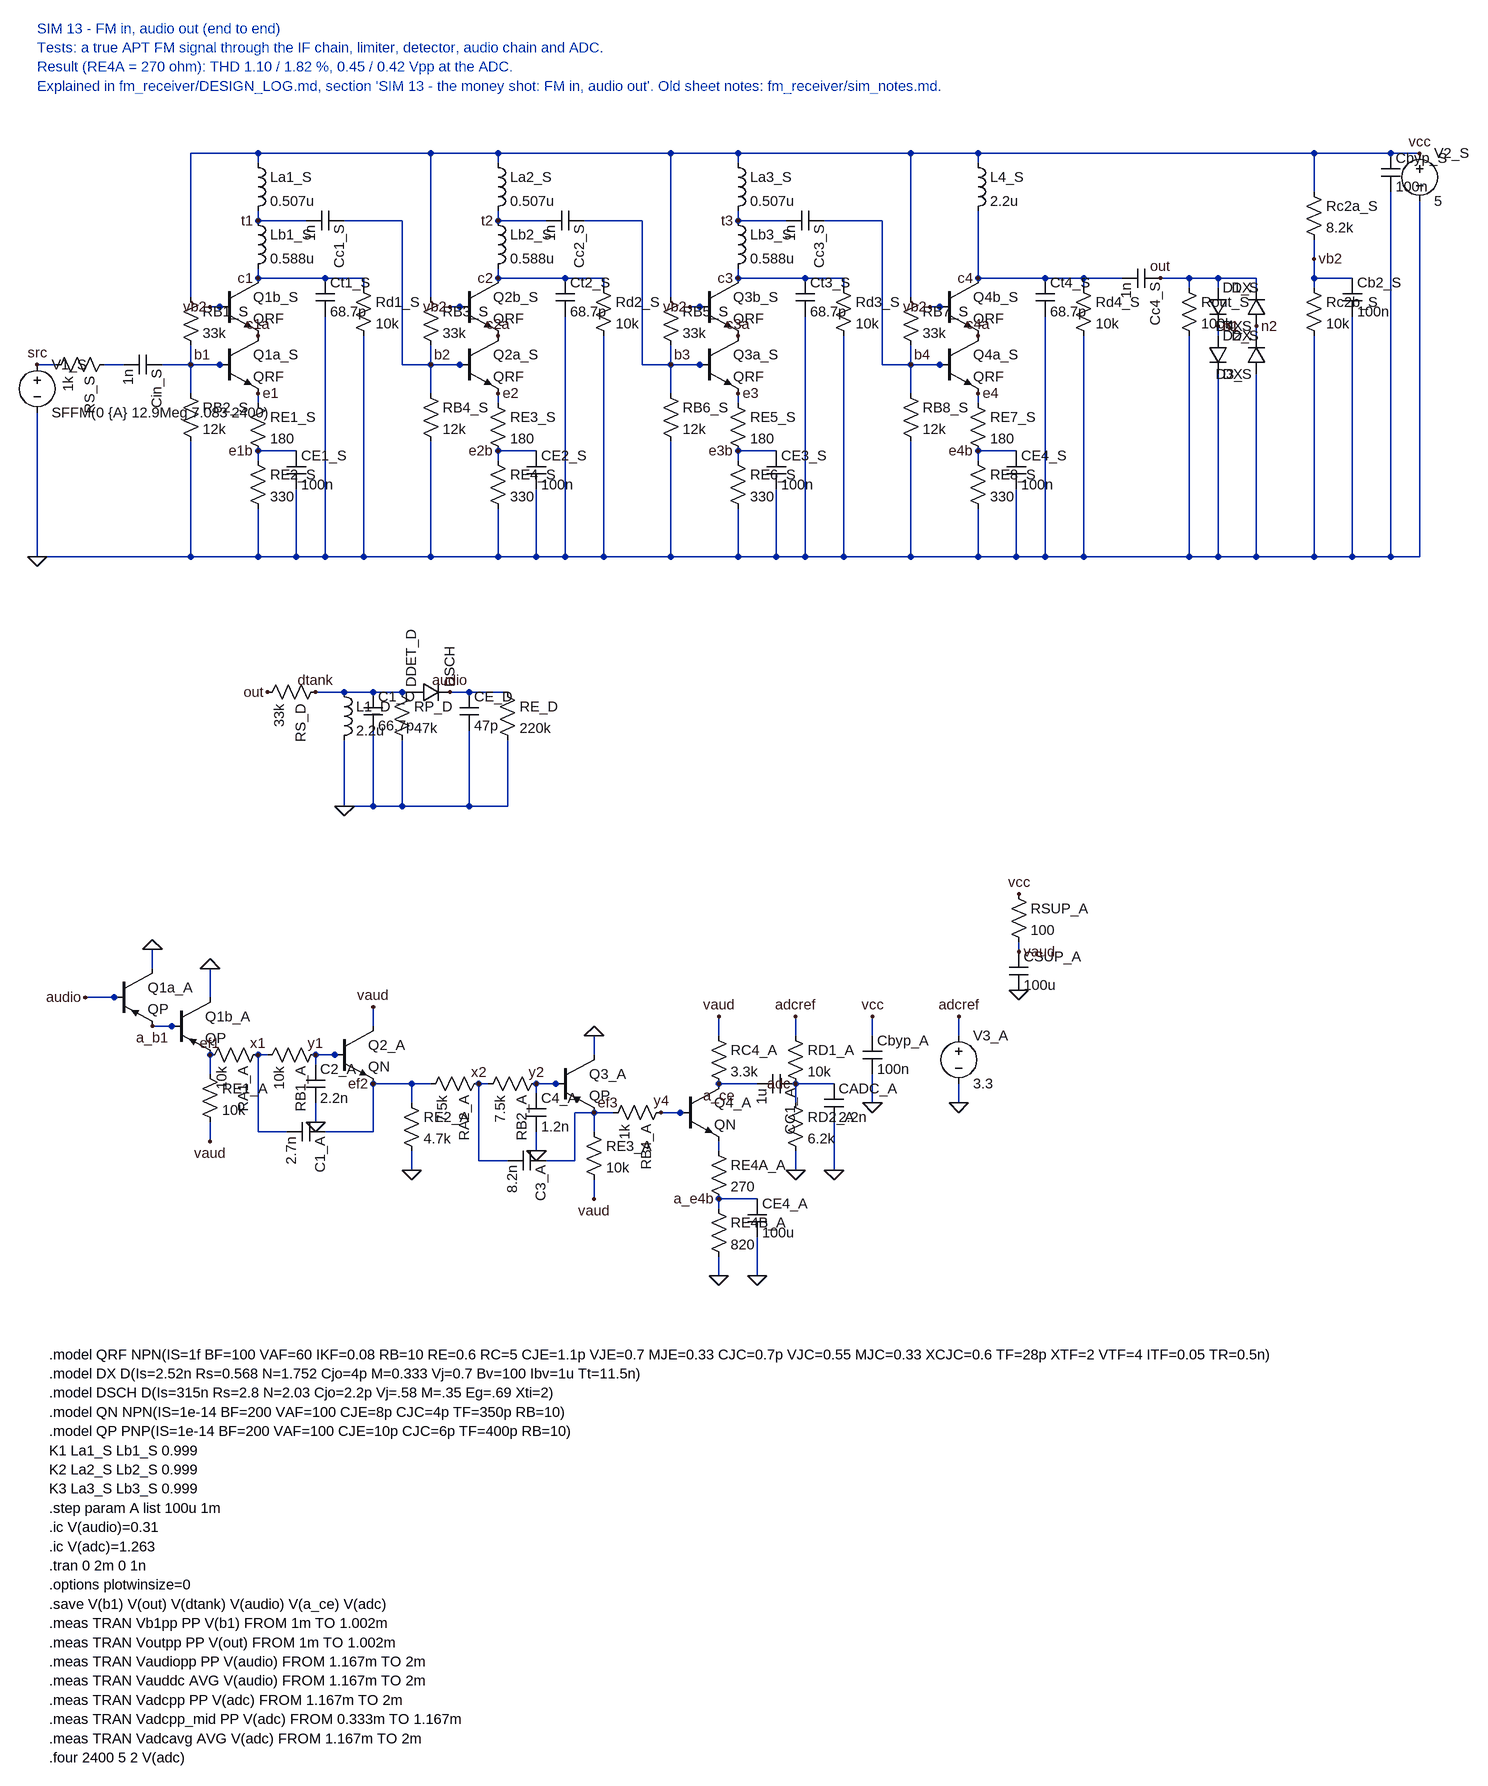
[diagram p0: schematic sim13_fm_endtoend.asc]
sim13_fm_endtoend.asc, the LTspice schematic file:
Version 4
SHEET 1 2600 3400
WIRE 336 48 448 48
WIRE 448 48 736 48
WIRE 736 48 848 48
WIRE 848 48 1136 48
WIRE 1136 48 1248 48
WIRE 1248 48 1536 48
WIRE 1536 48 1648 48
WIRE 1648 48 2208 48
WIRE 2208 48 2336 48
WIRE 2336 48 2384 48
WIRE 336 48 336 288
WIRE 448 48 448 64
WIRE 736 48 736 288
WIRE 848 48 848 64
WIRE 1136 48 1136 288
WIRE 1248 48 1248 64
WIRE 1536 48 1536 288
WIRE 1648 48 1648 64
WIRE 2208 48 2208 112
WIRE 80 400 112 400
WIRE 192 400 224 400
WIRE 288 400 336 400
WIRE 80 480 80 720
WIRE 336 368 336 448
WIRE 336 528 336 720
WIRE 336 400 400 400
WIRE 368 304 400 304
WIRE 448 144 448 160
WIRE 448 240 448 256
WIRE 448 256 560 256
WIRE 560 256 624 256
WIRE 624 256 624 272
WIRE 624 352 624 720
WIRE 560 320 560 720
WIRE 448 448 448 464
WIRE 448 544 448 560
WIRE 448 544 512 544
WIRE 448 640 448 720
WIRE 512 608 512 720
WIRE 448 160 528 160
WIRE 592 160 688 160
WIRE 688 160 688 400
WIRE 688 400 736 400
WIRE 736 368 736 448
WIRE 736 528 736 720
WIRE 736 400 800 400
WIRE 768 304 800 304
WIRE 848 144 848 160
WIRE 848 240 848 256
WIRE 848 256 960 256
WIRE 960 256 1024 256
WIRE 1024 256 1024 272
WIRE 1024 352 1024 720
WIRE 960 320 960 720
WIRE 848 448 848 464
WIRE 848 544 848 560
WIRE 848 544 912 544
WIRE 848 640 848 720
WIRE 912 608 912 720
WIRE 848 160 928 160
WIRE 992 160 1088 160
WIRE 1088 160 1088 400
WIRE 1088 400 1136 400
WIRE 1136 368 1136 448
WIRE 1136 528 1136 720
WIRE 1136 400 1200 400
WIRE 1168 304 1200 304
WIRE 1248 144 1248 160
WIRE 1248 240 1248 256
WIRE 1248 256 1360 256
WIRE 1360 256 1424 256
WIRE 1424 256 1424 272
WIRE 1424 352 1424 720
WIRE 1360 320 1360 720
WIRE 1248 448 1248 464
WIRE 1248 544 1248 560
WIRE 1248 544 1312 544
WIRE 1248 640 1248 720
WIRE 1312 608 1312 720
WIRE 1248 160 1328 160
WIRE 1392 160 1488 160
WIRE 1488 160 1488 400
WIRE 1488 400 1536 400
WIRE 1536 368 1536 448
WIRE 1536 528 1536 720
WIRE 1536 400 1600 400
WIRE 1568 304 1600 304
WIRE 1648 144 1648 256
WIRE 1648 256 1760 256
WIRE 1760 256 1824 256
WIRE 1824 256 1824 272
WIRE 1824 352 1824 720
WIRE 1760 320 1760 720
WIRE 1648 448 1648 464
WIRE 1648 544 1648 560
WIRE 1648 544 1712 544
WIRE 1648 640 1648 720
WIRE 1712 608 1712 720
WIRE 1824 256 1888 256
WIRE 1952 256 2000 256
WIRE 2000 256 2048 256
WIRE 2048 256 2112 256
WIRE 2000 256 2000 272
WIRE 2000 352 2000 720
WIRE 2048 256 2048 272
WIRE 2048 336 2048 352
WIRE 2048 416 2048 720
WIRE 2112 256 2112 272
WIRE 2112 352 2112 336
WIRE 2112 416 2112 720
WIRE 2208 192 2208 272
WIRE 2208 256 2272 256
WIRE 2208 352 2208 720
WIRE 2272 320 2272 720
WIRE 2336 112 2336 720
WIRE 2384 128 2384 720
WIRE 80 720 336 720
WIRE 336 720 448 720
WIRE 448 720 512 720
WIRE 512 720 560 720
WIRE 560 720 624 720
WIRE 624 720 736 720
WIRE 736 720 848 720
WIRE 848 720 912 720
WIRE 912 720 960 720
WIRE 960 720 1024 720
WIRE 1024 720 1136 720
WIRE 1136 720 1248 720
WIRE 1248 720 1312 720
WIRE 1312 720 1360 720
WIRE 1360 720 1424 720
WIRE 1424 720 1536 720
WIRE 1536 720 1648 720
WIRE 1648 720 1712 720
WIRE 1712 720 1760 720
WIRE 1760 720 1824 720
WIRE 1824 720 2000 720
WIRE 2000 720 2048 720
WIRE 2048 720 2112 720
WIRE 2112 720 2208 720
WIRE 2208 720 2272 720
WIRE 2272 720 2336 720
WIRE 2336 720 2384 720
FLAG 80 720 0
FLAG 2384 48 vcc
FLAG 80 400 src
FLAG 336 400 b1
FLAG 448 160 t1
FLAG 448 256 c1
FLAG 448 352 c1a
FLAG 448 448 e1
FLAG 448 544 e1b
FLAG 368 304 vb2
FLAG 736 400 b2
FLAG 848 160 t2
FLAG 848 256 c2
FLAG 848 352 c2a
FLAG 848 448 e2
FLAG 848 544 e2b
FLAG 768 304 vb2
FLAG 1136 400 b3
FLAG 1248 160 t3
FLAG 1248 256 c3
FLAG 1248 352 c3a
FLAG 1248 448 e3
FLAG 1248 544 e3b
FLAG 1168 304 vb2
FLAG 1536 400 b4
FLAG 1648 256 c4
FLAG 1648 352 c4a
FLAG 1648 448 e4
FLAG 1648 544 e4b
FLAG 1568 304 vb2
FLAG 1952 256 out
FLAG 2048 336 n1
FLAG 2112 336 n2
FLAG 2208 224 vb2
SYMBOL voltage 80 384 R0
SYMATTR InstName V1_S
SYMATTR Value SFFM(0 {A} 12.9Meg 7.083 2400)
SYMBOL res 208 384 R90
SYMATTR InstName RS_S
SYMATTR Value 1k
SYMBOL cap 288 384 R90
SYMATTR InstName Cin_S
SYMATTR Value 1n
SYMBOL res 320 272 R0
SYMATTR InstName RB1_S
SYMATTR Value 33k
SYMBOL res 320 432 R0
SYMATTR InstName RB2_S
SYMATTR Value 12k
SYMBOL npn 384 256 R0
SYMATTR InstName Q1b_S
SYMATTR Value QRF
SYMBOL npn 384 352 R0
SYMATTR InstName Q1a_S
SYMATTR Value QRF
SYMBOL ind 432 48 R0
SYMATTR InstName La1_S
SYMATTR Value 0.507u
SYMBOL ind 432 144 R0
SYMATTR InstName Lb1_S
SYMATTR Value 0.588u
SYMBOL cap 544 256 R0
SYMATTR InstName Ct1_S
SYMATTR Value 68.7p
SYMBOL res 608 256 R0
SYMATTR InstName Rd1_S
SYMATTR Value 10k
SYMBOL res 432 448 R0
SYMATTR InstName RE1_S
SYMATTR Value 180
SYMBOL res 432 544 R0
SYMATTR InstName RE2_S
SYMATTR Value 330
SYMBOL cap 496 544 R0
SYMATTR InstName CE1_S
SYMATTR Value 100n
SYMBOL cap 592 144 R90
SYMATTR InstName Cc1_S
SYMATTR Value 1n
SYMBOL res 720 272 R0
SYMATTR InstName RB3_S
SYMATTR Value 33k
SYMBOL res 720 432 R0
SYMATTR InstName RB4_S
SYMATTR Value 12k
SYMBOL npn 784 256 R0
SYMATTR InstName Q2b_S
SYMATTR Value QRF
SYMBOL npn 784 352 R0
SYMATTR InstName Q2a_S
SYMATTR Value QRF
SYMBOL ind 832 48 R0
SYMATTR InstName La2_S
SYMATTR Value 0.507u
SYMBOL ind 832 144 R0
SYMATTR InstName Lb2_S
SYMATTR Value 0.588u
SYMBOL cap 944 256 R0
SYMATTR InstName Ct2_S
SYMATTR Value 68.7p
SYMBOL res 1008 256 R0
SYMATTR InstName Rd2_S
SYMATTR Value 10k
SYMBOL res 832 448 R0
SYMATTR InstName RE3_S
SYMATTR Value 180
SYMBOL res 832 544 R0
SYMATTR InstName RE4_S
SYMATTR Value 330
SYMBOL cap 896 544 R0
SYMATTR InstName CE2_S
SYMATTR Value 100n
SYMBOL cap 992 144 R90
SYMATTR InstName Cc2_S
SYMATTR Value 1n
SYMBOL res 1120 272 R0
SYMATTR InstName RB5_S
SYMATTR Value 33k
SYMBOL res 1120 432 R0
SYMATTR InstName RB6_S
SYMATTR Value 12k
SYMBOL npn 1184 256 R0
SYMATTR InstName Q3b_S
SYMATTR Value QRF
SYMBOL npn 1184 352 R0
SYMATTR InstName Q3a_S
SYMATTR Value QRF
SYMBOL ind 1232 48 R0
SYMATTR InstName La3_S
SYMATTR Value 0.507u
SYMBOL ind 1232 144 R0
SYMATTR InstName Lb3_S
SYMATTR Value 0.588u
SYMBOL cap 1344 256 R0
SYMATTR InstName Ct3_S
SYMATTR Value 68.7p
SYMBOL res 1408 256 R0
SYMATTR InstName Rd3_S
SYMATTR Value 10k
SYMBOL res 1232 448 R0
SYMATTR InstName RE5_S
SYMATTR Value 180
SYMBOL res 1232 544 R0
SYMATTR InstName RE6_S
SYMATTR Value 330
SYMBOL cap 1296 544 R0
SYMATTR InstName CE3_S
SYMATTR Value 100n
SYMBOL cap 1392 144 R90
SYMATTR InstName Cc3_S
SYMATTR Value 1n
SYMBOL res 1520 272 R0
SYMATTR InstName RB7_S
SYMATTR Value 33k
SYMBOL res 1520 432 R0
SYMATTR InstName RB8_S
SYMATTR Value 12k
SYMBOL npn 1584 256 R0
SYMATTR InstName Q4b_S
SYMATTR Value QRF
SYMBOL npn 1584 352 R0
SYMATTR InstName Q4a_S
SYMATTR Value QRF
SYMBOL ind 1632 48 R0
SYMATTR InstName L4_S
SYMATTR Value 2.2u
SYMBOL cap 1744 256 R0
SYMATTR InstName Ct4_S
SYMATTR Value 68.7p
SYMBOL res 1808 256 R0
SYMATTR InstName Rd4_S
SYMATTR Value 10k
SYMBOL res 1632 448 R0
SYMATTR InstName RE7_S
SYMATTR Value 180
SYMBOL res 1632 544 R0
SYMATTR InstName RE8_S
SYMATTR Value 330
SYMBOL cap 1696 544 R0
SYMATTR InstName CE4_S
SYMATTR Value 100n
SYMBOL cap 1952 240 R90
SYMATTR InstName Cc4_S
SYMATTR Value 1n
SYMBOL res 1984 256 R0
SYMATTR InstName Rout_S
SYMATTR Value 100k
SYMBOL diode 2032 272 R0
SYMATTR InstName D1_S
SYMATTR Value DX
SYMBOL diode 2032 352 R0
SYMATTR InstName D2_S
SYMATTR Value DX
SYMBOL diode 2128 336 R180
SYMATTR InstName D4_S
SYMATTR Value DX
SYMBOL diode 2128 416 R180
SYMATTR InstName D3_S
SYMATTR Value DX
SYMBOL res 2192 96 R0
SYMATTR InstName Rc2a_S
SYMATTR Value 8.2k
SYMBOL res 2192 256 R0
SYMATTR InstName Rc2b_S
SYMATTR Value 10k
SYMBOL cap 2256 256 R0
SYMATTR InstName Cb2_S
SYMATTR Value 100n
SYMBOL cap 2320 48 R0
SYMATTR InstName Cbyp_S
SYMATTR Value 100n
SYMBOL voltage 2384 32 R0
SYMATTR InstName V2_S
SYMATTR Value 5
WIRE 544 1096 704 1096
WIRE 592 1176 592 1336
WIRE 640 1160 640 1336
WIRE 688 1176 688 1336
WIRE 768 1096 864 1096
WIRE 800 1160 800 1336
WIRE 864 1176 864 1336
WIRE 592 1336 640 1336
WIRE 640 1336 688 1336
WIRE 688 1336 800 1336
WIRE 800 1336 864 1336
FLAG 544 1096 dtank
FLAG 768 1096 audio
SYMBOL res 560 1080 R90
SYMATTR InstName RS_D
SYMATTR Value 33k
SYMBOL ind 576 1080 R0
SYMATTR InstName L1_D
SYMATTR Value 2.2u
SYMBOL cap 624 1096 R0
SYMATTR InstName C1_D
SYMATTR Value 66.7p
SYMBOL res 672 1080 R0
SYMATTR InstName RP_D
SYMATTR Value 47k
SYMBOL diode 704 1112 R270
SYMATTR InstName DDET_D
SYMATTR Value DSCH
SYMBOL cap 784 1096 R0
SYMATTR InstName CE_D
SYMATTR Value 47p
SYMBOL res 848 1080 R0
SYMATTR InstName RE_D
SYMATTR Value 220k
FLAG 464 1096 out
FLAG 592 1336 0
WIRE 160 2088 224 2088
WIRE 272 2040 272 2008
WIRE 272 2136 320 2136
WIRE 368 2088 368 2040
WIRE 368 2184 368 2216
WIRE 368 2296 368 2328
WIRE 448 2184 464 2184
WIRE 544 2184 544 2200
WIRE 544 2264 544 2296
WIRE 544 2184 592 2184
WIRE 640 2136 640 2104
WIRE 640 2232 704 2232
WIRE 704 2232 704 2264
WIRE 704 2344 704 2376
WIRE 448 2184 448 2312
WIRE 448 2312 496 2312
WIRE 560 2312 640 2312
WIRE 640 2312 640 2232
WIRE 704 2232 736 2232
WIRE 816 2232 832 2232
WIRE 912 2232 912 2248
WIRE 912 2312 912 2344
WIRE 912 2232 960 2232
WIRE 1008 2184 1008 2152
WIRE 1008 2280 1008 2312
WIRE 1008 2392 1008 2424
WIRE 816 2232 816 2360
WIRE 816 2360 864 2360
WIRE 928 2360 976 2360
WIRE 976 2360 976 2280
WIRE 976 2280 1008 2280
WIRE 1008 2280 1040 2280
WIRE 1120 2280 1168 2280
WIRE 1216 2152 1216 2120
WIRE 1216 2328 1216 2344
WIRE 1216 2424 1216 2440
WIRE 1216 2520 1216 2552
WIRE 1216 2424 1280 2424
WIRE 1280 2488 1280 2552
WIRE 1216 2232 1280 2232
WIRE 1344 2152 1344 2120
WIRE 1344 2232 1344 2264
WIRE 1344 2344 1344 2376
WIRE 1344 2232 1408 2232
WIRE 1408 2296 1408 2376
WIRE 1472 2152 1472 2120
WIRE 1472 2216 1472 2264
WIRE 1616 2152 1616 2120
WIRE 1616 2232 1616 2264
FLAG 160 2088 audio
FLAG 272 2008 0
FLAG 272 2136 a_b1
FLAG 368 2040 0
FLAG 368 2184 ef1
FLAG 368 2328 vaud
FLAG 448 2184 x1
FLAG 544 2184 y1
FLAG 544 2296 0
FLAG 640 2104 vaud
FLAG 640 2232 ef2
FLAG 704 2376 0
FLAG 816 2232 x2
FLAG 912 2232 y2
FLAG 912 2344 0
FLAG 1008 2152 0
FLAG 1008 2280 ef3
FLAG 1008 2424 vaud
FLAG 1120 2280 y4
FLAG 1216 2120 vaud
FLAG 1216 2232 a_ce
FLAG 1216 2424 a_e4b
FLAG 1216 2552 0
FLAG 1280 2552 0
FLAG 1344 2120 adcref
FLAG 1344 2232 adc
FLAG 1344 2376 0
FLAG 1408 2376 0
FLAG 1472 2120 vcc
FLAG 1472 2264 0
FLAG 1616 2120 adcref
FLAG 1616 2264 0
SYMBOL pnp 208 2040 R0
SYMATTR InstName Q1a_A
SYMATTR Value QP
SYMBOL pnp 304 2088 R0
SYMATTR InstName Q1b_A
SYMATTR Value QP
SYMBOL res 352 2200 R0
SYMATTR InstName RE1_A
SYMATTR Value 10k
SYMBOL res 464 2168 R90
SYMATTR InstName RA1_A
SYMATTR Value 10k
SYMBOL res 560 2168 R90
SYMATTR InstName RB1_A
SYMATTR Value 10k
SYMBOL cap 528 2200 R0
SYMATTR InstName C2_A
SYMATTR Value 2.2n
SYMBOL npn 576 2136 R0
SYMATTR InstName Q2_A
SYMATTR Value QN
SYMBOL res 688 2248 R0
SYMATTR InstName RE2_A
SYMATTR Value 4.7k
SYMBOL cap 560 2296 R90
SYMATTR InstName C1_A
SYMATTR Value 2.7n
SYMBOL res 832 2216 R90
SYMATTR InstName RA2_A
SYMATTR Value 7.5k
SYMBOL res 928 2216 R90
SYMATTR InstName RB2_A
SYMATTR Value 7.5k
SYMBOL cap 896 2248 R0
SYMATTR InstName C4_A
SYMATTR Value 1.2n
SYMBOL pnp 944 2184 R0
SYMATTR InstName Q3_A
SYMATTR Value QP
SYMBOL res 992 2296 R0
SYMATTR InstName RE3_A
SYMATTR Value 10k
SYMBOL cap 928 2344 R90
SYMATTR InstName C3_A
SYMATTR Value 8.2n
SYMBOL res 1136 2264 R90
SYMATTR InstName RB4_A
SYMATTR Value 1k
SYMBOL npn 1152 2232 R0
SYMATTR InstName Q4_A
SYMATTR Value QN
SYMBOL res 1200 2136 R0
SYMATTR InstName RC4_A
SYMATTR Value 3.3k
SYMBOL res 1200 2328 R0
SYMATTR InstName RE4A_A
SYMATTR Value 270
SYMBOL res 1200 2424 R0
SYMATTR InstName RE4B_A
SYMATTR Value 820
SYMBOL cap 1264 2424 R0
SYMATTR InstName CE4_A
SYMATTR Value 100u
SYMBOL cap 1344 2216 R90
SYMATTR InstName CC1_A
SYMATTR Value 1u
SYMBOL res 1328 2136 R0
SYMATTR InstName RD1_A
SYMATTR Value 10k
SYMBOL res 1328 2248 R0
SYMATTR InstName RD2_A
SYMATTR Value 6.2k
SYMBOL cap 1392 2232 R0
SYMATTR InstName CADC_A
SYMATTR Value 2.2n
SYMBOL cap 1456 2152 R0
SYMATTR InstName Cbyp_A
SYMATTR Value 100n
SYMBOL voltage 1616 2136 R0
SYMATTR InstName V3_A
SYMATTR Value 3.3
SYMBOL res 1700 1900 R0
SYMATTR InstName RSUP_A
SYMATTR Value 100
SYMBOL cap 1700 2012 R0
SYMATTR InstName CSUP_A
SYMATTR Value 100u
WIRE 1716 1996 1716 2012
FLAG 1716 1916 vcc
FLAG 1716 2012 vaud
FLAG 1716 2076 0
TEXT 100 2700 Left 2 !.model QRF NPN(IS=1f BF=100 VAF=60 IKF=0.08 RB=10 RE=0.6 RC=5 CJE=1.1p VJE=0.7 MJE=0.33 CJC=0.7p VJC=0.55 MJC=0.33 XCJC=0.6 TF=28p XTF=2 VTF=4 ITF=0.05 TR=0.5n)
TEXT 100 2732 Left 2 !.model DX D(Is=2.52n Rs=0.568 N=1.752 Cjo=4p M=0.333 Vj=0.7 Bv=100 Ibv=1u Tt=11.5n)
TEXT 100 2764 Left 2 !.model DSCH D(Is=315n Rs=2.8 N=2.03 Cjo=2.2p Vj=.58 M=.35 Eg=.69 Xti=2)
TEXT 100 2796 Left 2 !.model QN NPN(IS=1e-14 BF=200 VAF=100 CJE=8p CJC=4p TF=350p RB=10)
TEXT 100 2828 Left 2 !.model QP PNP(IS=1e-14 BF=200 VAF=100 CJE=10p CJC=6p TF=400p RB=10)
TEXT 100 2860 Left 2 !K1 La1_S Lb1_S 0.999
TEXT 100 2892 Left 2 !K2 La2_S Lb2_S 0.999
TEXT 100 2924 Left 2 !K3 La3_S Lb3_S 0.999
TEXT 100 2956 Left 2 !.step param A list 100u 1m
TEXT 100 2988 Left 2 !.ic V(audio)=0.31
TEXT 100 3020 Left 2 !.ic V(adc)=1.263
TEXT 100 3052 Left 2 !.tran 0 2m 0 1n
TEXT 100 3084 Left 2 !.options plotwinsize=0
TEXT 100 3116 Left 2 !.save V(b1) V(out) V(dtank) V(audio) V(a_ce) V(adc)
TEXT 100 3148 Left 2 !.meas TRAN Vb1pp PP V(b1) FROM 1m TO 1.002m
TEXT 100 3180 Left 2 !.meas TRAN Voutpp PP V(out) FROM 1m TO 1.002m
TEXT 100 3212 Left 2 !.meas TRAN Vaudiopp PP V(audio) FROM 1.167m TO 2m
TEXT 100 3244 Left 2 !.meas TRAN Vauddc AVG V(audio) FROM 1.167m TO 2m
TEXT 100 3276 Left 2 !.meas TRAN Vadcpp PP V(adc) FROM 1.167m TO 2m
TEXT 100 3308 Left 2 !.meas TRAN Vadcpp_mid PP V(adc) FROM 0.333m TO 1.167m
TEXT 100 3340 Left 2 !.meas TRAN Vadcavg AVG V(adc) FROM 1.167m TO 2m
TEXT 100 3372 Left 2 !.four 2400 5 2 V(adc)
TEXT 80 -160 Left 2 ;SIM 13 - FM in, audio out (end to end)
TEXT 80 -128 Left 2 ;Tests: a true APT FM signal through the IF chain, limiter, detector, audio chain and ADC.
TEXT 80 -96 Left 2 ;Result (RE4A = 270 ohm): THD 1.10 / 1.82 %, 0.45 / 0.42 Vpp at the ADC.
TEXT 80 -64 Left 2 ;Explained in fm_receiver/DESIGN_LOG.md, section 'SIM 13 - the money shot: FM in, audio out'. Old sheet notes: fm_receiver/sim_notes.md.

The netlist it stands for:
* sim13_fm_endtoend.asc
V1_S src 0 SFFM(0 {A} 12.9Meg 7.083 2400)
RS_S N001 src 1k
Cin_S b1 N001 1n
RB1_S vcc b1 33k
RB2_S b1 0 12k
Q1b_S c1 vb2 c1a 0 QRF
Q1a_S c1a b1 e1 0 QRF
La1_S vcc t1 0.507u
Lb1_S t1 c1 0.588u
Ct1_S c1 0 68.7p
Rd1_S c1 0 10k
RE1_S e1 e1b 180
RE2_S e1b 0 330
CE1_S e1b 0 100n
Cc1_S b2 t1 1n
RB3_S vcc b2 33k
RB4_S b2 0 12k
Q2b_S c2 vb2 c2a 0 QRF
Q2a_S c2a b2 e2 0 QRF
La2_S vcc t2 0.507u
Lb2_S t2 c2 0.588u
Ct2_S c2 0 68.7p
Rd2_S c2 0 10k
RE3_S e2 e2b 180
RE4_S e2b 0 330
CE2_S e2b 0 100n
Cc2_S b3 t2 1n
RB5_S vcc b3 33k
RB6_S b3 0 12k
Q3b_S c3 vb2 c3a 0 QRF
Q3a_S c3a b3 e3 0 QRF
La3_S vcc t3 0.507u
Lb3_S t3 c3 0.588u
Ct3_S c3 0 68.7p
Rd3_S c3 0 10k
RE5_S e3 e3b 180
RE6_S e3b 0 330
CE3_S e3b 0 100n
Cc3_S b4 t3 1n
RB7_S vcc b4 33k
RB8_S b4 0 12k
Q4b_S c4 vb2 c4a 0 QRF
Q4a_S c4a b4 e4 0 QRF
L4_S vcc c4 2.2u
Ct4_S c4 0 68.7p
Rd4_S c4 0 10k
RE7_S e4 e4b 180
RE8_S e4b 0 330
CE4_S e4b 0 100n
Cc4_S out c4 1n
Rout_S out 0 100k
D1_S out n1 DX
D2_S n1 0 DX
D4_S n2 out DX
D3_S 0 n2 DX
Rc2a_S vcc vb2 8.2k
Rc2b_S vb2 0 10k
Cb2_S vb2 0 100n
Cbyp_S vcc 0 100n
V2_S vcc 0 5
RS_D dtank out 33k
L1_D dtank 0 2.2u
C1_D dtank 0 66.7p
RP_D dtank 0 47k
DDET_D dtank audio DSCH
CE_D audio 0 47p
RE_D audio 0 220k
Q1a_A 0 audio a_b1 0 QP
Q1b_A 0 a_b1 ef1 0 QP
RE1_A ef1 vaud 10k
RA1_A x1 ef1 10k
RB1_A y1 x1 10k
C2_A y1 0 2.2n
Q2_A vaud y1 ef2 0 QN
RE2_A ef2 0 4.7k
C1_A ef2 x1 2.7n
RA2_A x2 ef2 7.5k
RB2_A y2 x2 7.5k
C4_A y2 0 1.2n
Q3_A 0 y2 ef3 0 QP
RE3_A ef3 vaud 10k
C3_A ef3 x2 8.2n
RB4_A y4 ef3 1k
Q4_A a_ce y4 N002 0 QN
RC4_A vaud a_ce 3.3k
RE4A_A N002 a_e4b 270
RE4B_A a_e4b 0 820
CE4_A a_e4b 0 100u
CC1_A adc a_ce 1u
RD1_A adcref adc 10k
RD2_A adc 0 6.2k
CADC_A adc 0 2.2n
Cbyp_A vcc 0 100n
V3_A adcref 0 3.3
RSUP_A vcc vaud 100
CSUP_A vaud 0 100u
.model D D
.lib standard.dio
.model NPN NPN
.model PNP PNP
.lib standard.bjt
.model QRF NPN(IS=1f BF=100 VAF=60 IKF=0.08 RB=10 RE=0.6 RC=5 CJE=1.1p VJE=0.7 MJE=0.33 CJC=0.7p VJC=0.55 MJC=0.33 XCJC=0.6 TF=28p XTF=2 VTF=4 ITF=0.05 TR=0.5n)
.model DX D(Is=2.52n Rs=0.568 N=1.752 Cjo=4p M=0.333 Vj=0.7 Bv=100 Ibv=1u Tt=11.5n)
.model DSCH D(Is=315n Rs=2.8 N=2.03 Cjo=2.2p Vj=.58 M=.35 Eg=.69 Xti=2)
.model QN NPN(IS=1e-14 BF=200 VAF=100 CJE=8p CJC=4p TF=350p RB=10)
.model QP PNP(IS=1e-14 BF=200 VAF=100 CJE=10p CJC=6p TF=400p RB=10)
K1 La1_S Lb1_S 0.999
K2 La2_S Lb2_S 0.999
K3 La3_S Lb3_S 0.999
.step param A list 100u 1m
.ic V(audio)=0.31
.ic V(adc)=1.263
.tran 0 2m 0 1n
.options plotwinsize=0
.save V(b1) V(out) V(dtank) V(audio) V(a_ce) V(adc)
.meas TRAN Vb1pp PP V(b1) FROM 1m TO 1.002m
.meas TRAN Voutpp PP V(out) FROM 1m TO 1.002m
.meas TRAN Vaudiopp PP V(audio) FROM 1.167m TO 2m
.meas TRAN Vauddc AVG V(audio) FROM 1.167m TO 2m
.meas TRAN Vadcpp PP V(adc) FROM 1.167m TO 2m
.meas TRAN Vadcpp_mid PP V(adc) FROM 0.333m TO 1.167m
.meas TRAN Vadcavg AVG V(adc) FROM 1.167m TO 2m
.four 2400 5 2 V(adc)
* SIM 13 - FM in, audio out (end to end)
* Tests: a true APT FM signal through the IF chain, limiter, detector, audio chain and ADC.
* Result (RE4A = 270 ohm): THD 1.10 / 1.82 %, 0.45 / 0.42 Vpp at the ADC.
* Explained in fm_receiver/DESIGN_LOG.md, section 'SIM 13 - the money shot: FM in, audio out'. Old sheet notes: fm_receiver/sim_notes.md.
.backanno
.end